# EAGLE schematic ATX_Power_Breakout_v1p0 (EAGLE 9.5.1)
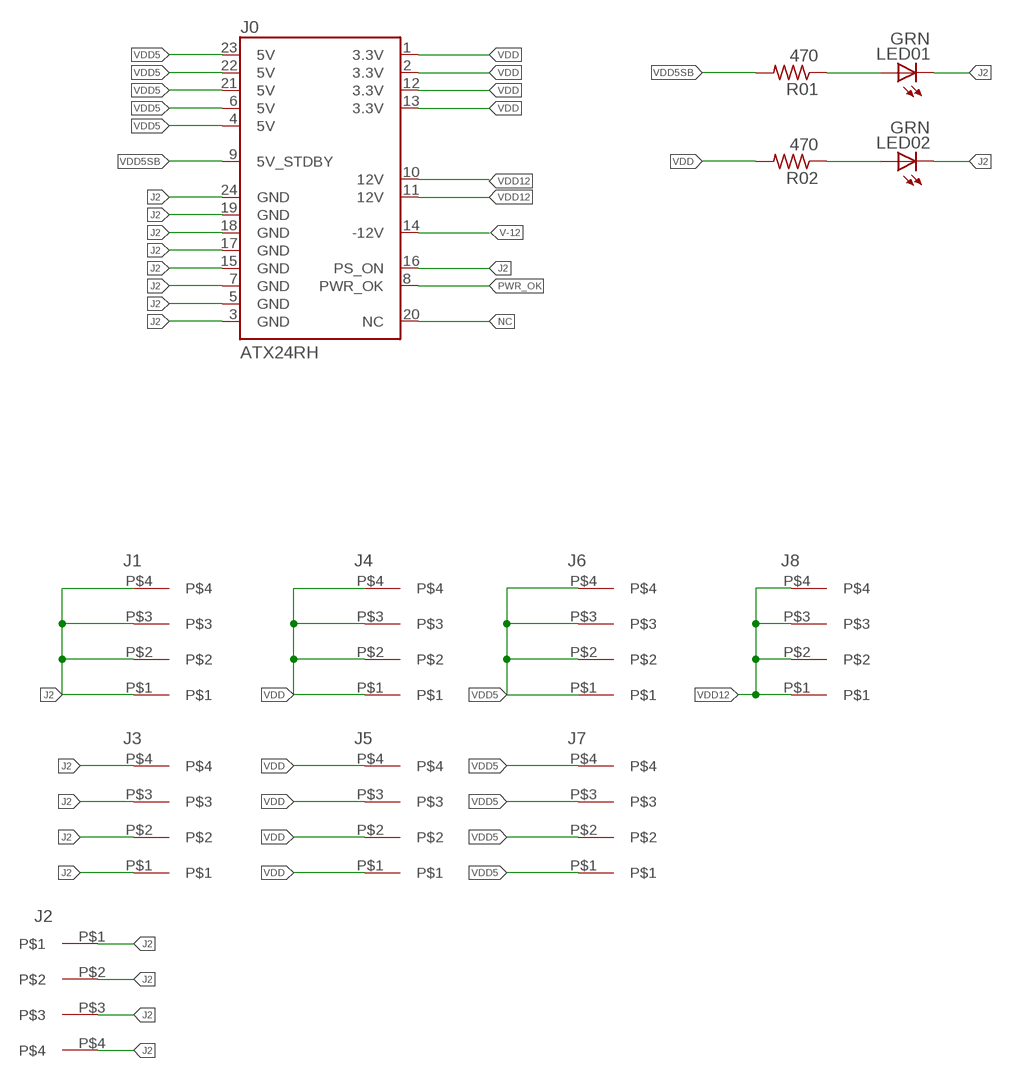
[diagram p0: schematic, sheet 1]

## Parts
J0  ATX24RH  [ATX24_RIGHT_ANGLE]
J1  3.81MM_1_X_4_RT_ANGLE_PLUG_HEADER  [1X4_3.81MM_PITCH]
J2  3.81MM_1_X_4_RT_ANGLE_PLUG_HEADER  [1X4_3.81MM_PITCH]
J3  3.81MM_1_X_4_RT_ANGLE_PLUG_HEADER  [1X4_3.81MM_PITCH]
J4  3.81MM_1_X_4_RT_ANGLE_PLUG_HEADER  [1X4_3.81MM_PITCH]
J5  3.81MM_1_X_4_RT_ANGLE_PLUG_HEADER  [1X4_3.81MM_PITCH]
J6  3.81MM_1_X_4_RT_ANGLE_PLUG_HEADER  [1X4_3.81MM_PITCH]
J7  3.81MM_1_X_4_RT_ANGLE_PLUG_HEADER  [1X4_3.81MM_PITCH]
J8  3.81MM_1_X_4_RT_ANGLE_PLUG_HEADER  [1X4_3.81MM_PITCH]
LED01  GREEN  LED_0805_GREEN  [LED_0805_GREEN]
LED02  GREEN  LED_0805_GREEN  [LED_0805_GREEN]
R01  470  R_0805  [0805]
R02  470  R_0805  [0805]

## Nets
J2: J0.3(GND) J0.5(GND) J0.7(GND) J0.15(GND) J0.16(PS_ON) J0.17(GND) J0.18(GND) J0.19(GND) J0.24(GND) J1.P$1 J1.P$2 J1.P$3 J1.P$4 J2.P$1 J2.P$2 J2.P$3 J2.P$4 J3.P$1 J3.P$2 J3.P$3 J3.P$4 LED01.C LED02.C
N$4: LED01.A R01.1
N$5: LED02.A R02.1
NC: J0.20(NC)
PWR_OK: J0.8(PWR_OK)
V-12: J0.14(-12V)
VDD: J0.1(3.3V) J0.2(3.3V) J0.12(3.3V) J0.13(3.3V) J4.P$1 J4.P$2 J4.P$3 J4.P$4 J5.P$1 J5.P$2 J5.P$3 J5.P$4 R02.2
VDD5: J0.4(5V) J0.6(5V) J0.21(5V) J0.22(5V) J0.23(5V) J6.P$1 J6.P$2 J6.P$3 J6.P$4 J7.P$1 J7.P$2 J7.P$3 J7.P$4
VDD5SB: J0.9(5V_STDBY) R01.2
VDD12: J0.10(12V) J0.11(12V) J8.P$1 J8.P$2 J8.P$3 J8.P$4

## Library data of the parts
J0 = 3D_MIG_Controller:ATX24: ATX24 Pin Power Supply Connector - Right Angle PTH Mount This is a good connector for connecting a computer power supply to a PCB. It's massive, but provides many amps of power at 5V and 12V. SparkFun Products: SparkFun Benchtop Power Board Kit <https://www.sparkfun.com/products/12867> SparkFun Power Driver Shield Kit <https://www.sparkfun.com/products/10618>; PROD_ID: CONN-09674; SF_ID: PRT-09498
J1-J8 = 3D_MIG_Controller:3.81MM_1_X_4_RT_ANGLE_PLUG_HEADER
LED01 LED02 = 3D_MIG_Controller:LED_0805_GREEN
R01 R02 = 3D_MIG_Controller:R_0805